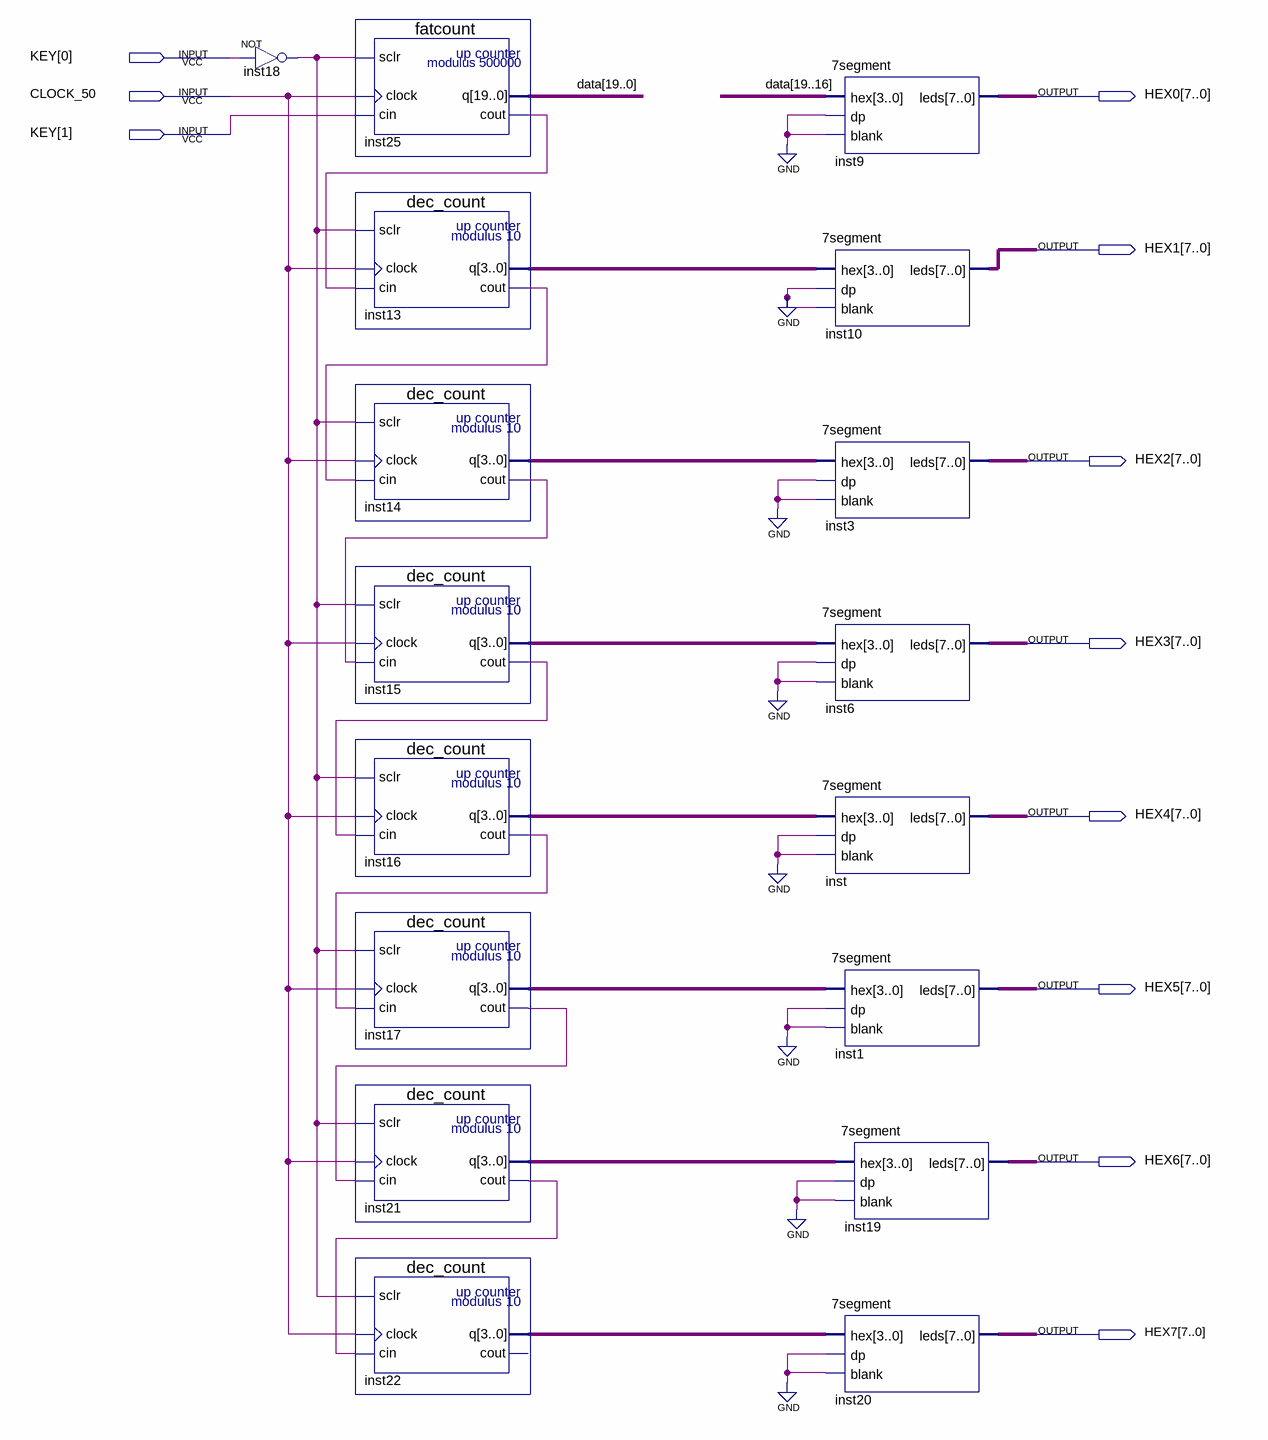
[diagram p0: schematic sheet]
// Quartus schematic Counter.bdf as structural Verilog: 17 symbols, 11 pins
module Counter (
  input  [1:0] KEY,
  input  CLOCK_50,
  output [7:0] HEX0,
  output [7:0] HEX1,
  output [7:0] HEX2,
  output [7:0] HEX3,
  output [7:0] HEX4,
  output [7:0] HEX5,
  output [7:0] HEX6,
  output [7:0] HEX7
);

  wire inst13_cout, inst14_cout, inst15_cout, inst16_cout, inst17_cout, inst18_out, inst21_cout, inst25_cout;
  wire [3:0] inst13_q, inst14_q, inst15_q, inst16_q, inst17_q, inst21_q, inst22_q;
  wire [19:0] data;

  not inst18 (inst18_out, KEY[0]);
  fatcount inst25 (.sclr(inst18_out), .clock(CLOCK_50), .cin(KEY[1]), .cout(inst25_cout), .q(data));
  dec_count inst13 (.sclr(inst18_out), .clock(CLOCK_50), .cin(inst25_cout), .cout(inst13_cout), .q(inst13_q));
  dec_count inst14 (.sclr(inst18_out), .clock(CLOCK_50), .cin(inst13_cout), .cout(inst14_cout), .q(inst14_q));
  dec_count inst15 (.sclr(inst18_out), .clock(CLOCK_50), .cin(inst14_cout), .cout(inst15_cout), .q(inst15_q));
  dec_count inst16 (.sclr(inst18_out), .clock(CLOCK_50), .cin(inst15_cout), .cout(inst16_cout), .q(inst16_q));
  dec_count inst17 (.sclr(inst18_out), .clock(CLOCK_50), .cin(inst16_cout), .cout(inst17_cout), .q(inst17_q));
  dec_count inst21 (.sclr(inst18_out), .clock(CLOCK_50), .cin(inst17_cout), .cout(inst21_cout), .q(inst21_q));
  dec_count inst22 (.sclr(inst18_out), .clock(CLOCK_50), .cin(inst21_cout), .q(inst22_q));  // open: cout
  \7segment  inst9 (.hex(data[19:16]), .dp(1'b0), .blank(1'b0), .leds(HEX0));
  \7segment  inst10 (.hex(inst13_q), .dp(1'b0), .blank(1'b0), .leds(HEX1));
  \7segment  inst3 (.hex(inst14_q), .dp(1'b0), .blank(1'b0), .leds(HEX2));
  \7segment  inst6 (.hex(inst15_q), .dp(1'b0), .blank(1'b0), .leds(HEX3));
  \7segment  inst (.hex(inst16_q), .dp(1'b0), .blank(1'b0), .leds(HEX4));
  \7segment  inst1 (.hex(inst17_q), .dp(1'b0), .blank(1'b0), .leds(HEX5));
  \7segment  inst19 (.hex(inst21_q), .dp(1'b0), .blank(1'b0), .leds(HEX6));
  \7segment  inst20 (.hex(inst22_q), .dp(1'b0), .blank(1'b0), .leds(HEX7));
endmodule
